# Altium schematic sheet Main.SchDoc
size 508 x 299 mm; SheetNumber: 1; SheetTotal: 2
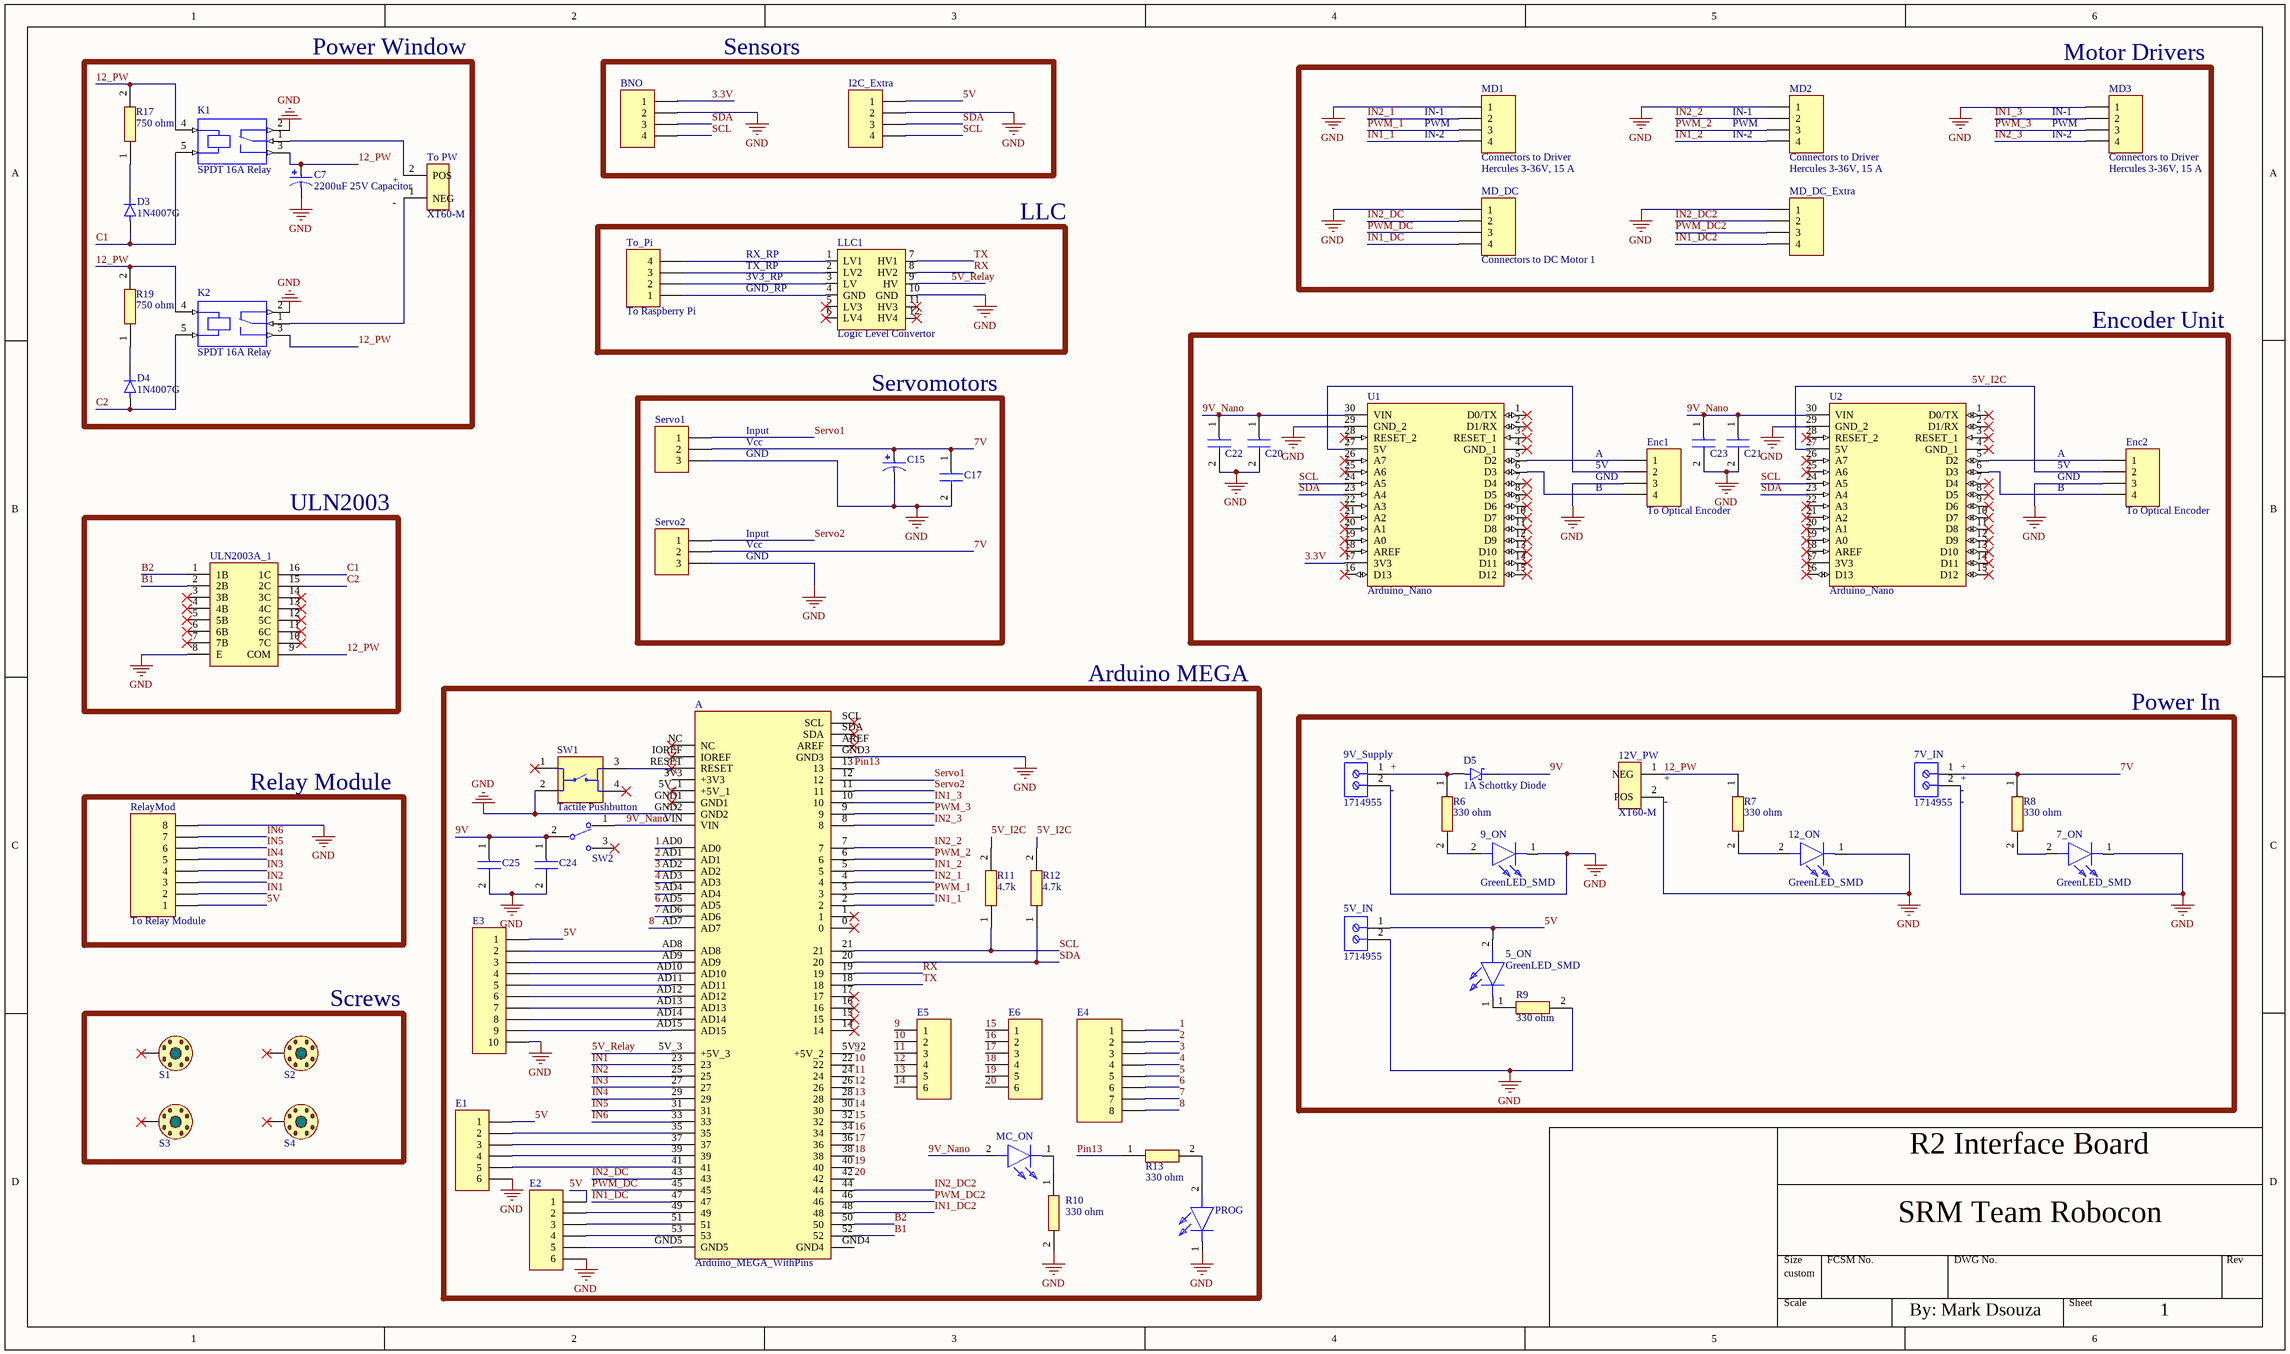
[diagram p0: Main.SchDoc]

## Parts
5_ON  GreenLED_SMD  [3mm LED]
5V_IN  1714955  [6.35mm 2 Way Screw Terminal]
7_ON  GreenLED_SMD  [3mm LED]
7V_IN  1714955  [6.35mm 2 Way Screw Terminal]
9_ON  GreenLED_SMD  [3mm LED]
9V_Supply  1714955  [6.35mm 2 Way Screw Terminal]
12_ON  GreenLED_SMD  [3mm LED]
12V_PW  XT60-M  [AMASS_XT60-M]
A  Arduino_MEGA_WithPins  [ARDUINO_MEGA_WithPins]
BNO  BNO  [Header JST 1X04]  (value not drawn)
C7  2200uF 25V Capacitor  [2200uF 25V Capacitor_FINAL]
C15  2200uF 25V Capacitor  [2200uF 25V Capacitor_FINAL]  (value not drawn)
C17  0.01uF Capacitor  [CAPC3216X170N]  (value not drawn)
C20  0.01uF Capacitor  [CAPC3216X170N]  (value not drawn)
C21  0.01uF Capacitor  [CAPC3216X170N]  (value not drawn)
C22  10 uF Capacitor  [CAPC3216X170N]  (value not drawn)
C23  10uF Capacitor  [CAPC3216X170N]  (value not drawn)
C24  0.01uF Capacitor  [CAPC3216X170N]  (value not drawn)
C25  10 uF Capacitor  [CAPC3216X170N]  (value not drawn)
D3  1N4007G  [1n4007]
D4  1N4007G  [1n4007]
D5  1A Schottky Diode  [1A Schottky Diode]
E1  Header 6  [My_1X06]  (value not drawn)
E2  Header 6  [My_1X06]  (value not drawn)
E3  Header 10  [MY_MA10-1]  (value not drawn)
E4  Header 8  [MY_1X08]  (value not drawn)
E5  Header 6  [My_1X06]  (value not drawn)
E6  Header 6  [My_1X06]  (value not drawn)
Enc1  To Optical Encoder  [Header JST 1X04]
Enc2  To Optical Encoder  [Header JST 1X04]
I2C_Extra  Header 4  [Header JST 1X04]  (value not drawn)
K1  SPDT 16A Relay  [relay JQX-15F(T90)]
K2  SPDT 16A Relay  [relay JQX-15F(T90)]
LLC1  Logic Level Convertor  [LLC]
MC_ON  GreenLED_SMD  [3mm LED]  (value not drawn)
MD1  Connectors to Driver  [Header JST 1X04]
MD2  Connectors to Driver  [Header JST 1X04]
MD3  Connectors to Driver  [Header JST 1X04]
MD_DC  Connectors to DC Motor 1  [Header JST 1X04]
MD_DC_Extra  Connectors to DC Motor 2  [Header JST 1X04]  (value not drawn)
PROG  GreenLED_SMD  [3mm LED]  (value not drawn)
R6  330 ohm  [RESC3116X65N]
R7  330 ohm  [RESC3116X65N]
R8  330 ohm  [RESC3116X65N]
R9  330 ohm  [RESC3116X65N]
R10  330 ohm  [RESC3116X65N]
R11  4.7k  [RESC3116X65N]
R12  4.7k  [RESC3116X65N]
R13  330 ohm  [RESC3116X65N]
R17  750 ohm  [RESC3116X65N]
R19  750 ohm  [RESC3116X65N]
RelayMod  To Relay Module  [Header JST 1X08]
S1  Screw  [SCREW-2MM]  (value not drawn)  (net tie, no BOM)
S2  Screw  [SCREW-2MM]  (value not drawn)  (net tie, no BOM)
S3  Screw  [SCREW-2MM]  (value not drawn)  (net tie, no BOM)
S4  Screw  [SCREW-2MM]  (value not drawn)  (net tie, no BOM)
Servo1  Header 3  [Header JST 1X03]  (value not drawn)
Servo2  Header 3  [Header JST 1X03]  (value not drawn)
SW1  Tactile Pushbutton  [Tactile Pushbutton]
SW2  1825115-1  [SPDT Slider Switch]  (value not drawn)
To_Pi  To Raspberry Pi  [Header JST 1X04]
To_PW  XT60-M  [AMASS_XT60-M]
U1  Arduino_Nano  [Arduino_Nano]
U2  Arduino_Nano  [Arduino_Nano]
ULN2003A_1  ULN2003AN  [ULN2003AN]  (value not drawn)

## Blocks framed on the sheet
Power Window: C7 D3 D4 K1 K2 R17 R19 To_PW
Sensors: BNO I2C_Extra
Motor Drivers: MD1-MD3 MD_DC MD_DC_Extra
LLC: LLC1 To_Pi
Encoder Unit: C20-C23 Enc1 Enc2 U1 U2
Servomotors: C15 C17 Servo1 Servo2
ULN2003: ULN2003A_1
Arduino MEGA: A C24 C25 E1-E6 MC_ON PROG R10-R13 SW1 SW2
Power In: 5_ON 5V_IN 7_ON 7V_IN 9_ON 9V_Supply 12_ON 12V_PW D5 R6-R9
Relay Module: RelayMod
Screws: S1-S4

## Nets
GND: 5V_IN.2 7_ON.1(K) 7V_IN.2 9_ON.1(K) 9V_Supply.2 12_ON.1(K) 12V_PW.2(POS) A.GND2 A.GND3 BNO.2 C7.N C15.N C17.2 C20.2 C21.2 C22.2 C23.2 C24.2 C25.2 E1.6 E2.6 E3.10 Enc1.3 Enc2.3 I2C_Extra.2 K1.2 K2.2 LLC1.10(GND) MD1.1 MD2.1 MD3.1 MD_DC.1 MD_DC_Extra.1 PROG.1(K) R9.2 R10.2 RelayMod.8 Servo1.3 Servo2.3 SW1.2 U1.29(GND_2) U2.29(GND_2) ULN2003A_1.8(E)
1: A.AD0 E4.1
2: A.AD1 E4.2
3: A.AD2 E4.3
3.3V: BNO.1 U1.17(3V3)
4: A.AD3 E4.4
5: A.AD4 E4.5
5V: 5_ON.2(A) 5V_IN.1 E1.1 E2.1 E3.1 I2C_Extra.1 RelayMod.1
5V_I2C: Enc2.2 R11.2 R12.2 U2.27(5V)
5V_Relay: A.5V_3(+5V_3) LLC1.9(HV)
6: A.AD5 E4.6
7: A.AD6 E4.7
7V: 7V_IN.1 C15.P C17.1 R8.1 Servo1.2 Servo2.2
8: A.AD7 E4.8
9: A.5V_2(+5V_2) E5.1
9V: C24.1 C25.1 D5.C(K) SW2.2
9V_Nano: A.VIN C20.1 C21.1 C22.1 C23.1 MC_ON.2(A) SW2.1 U1.30(VIN) U2.30(VIN)
10: A.22 E5.2
11: A.24 E5.3
12: A.26 E5.4
12_PW: 12V_PW.1(NEG) C7.P K1.3 K1.4(A1) K2.3 K2.4(A1) R7.1 R17.2 R19.2 ULN2003A_1.9(COM)
13: A.28 E5.5
14: A.30 E5.6
15: A.32 E6.1
16: A.34 E6.2
17: A.36 E6.3
18: A.38 E6.4
19: A.40 E6.5
20: A.42 E6.6
B1: A.52 ULN2003A_1.2(2B)
B2: A.50 ULN2003A_1.1(1B)
C1: D3.A K1.5(A2) ULN2003A_1.16(1C)
C2: D4.A K2.5(A2) ULN2003A_1.15(2C)
IN1: A.23 RelayMod.2
IN1_1: A.2 MD1.4
IN1_2: A.5 MD2.4
IN1_3: A.10 MD3.2
IN1_DC: A.47 MD_DC.4
IN1_DC2: A.48 MD_DC_Extra.4
IN2: A.25 RelayMod.3
IN2_1: A.4 MD1.2
IN2_2: A.7 MD2.2
IN2_3: A.8 MD3.4
IN2_DC: A.43 MD_DC.2
IN2_DC2: A.44 MD_DC_Extra.2
IN3: A.27 RelayMod.4
IN4: A.29 RelayMod.5
IN5: A.31 RelayMod.6
IN6: A.33 RelayMod.7
Pin13: A.13 R13.1
PWM_1: A.3 MD1.3
PWM_2: A.6 MD2.3
PWM_3: A.9 MD3.3
PWM_DC: A.45 MD_DC.3
PWM_DC2: A.46 MD_DC_Extra.3
RX: A.19 LLC1.8(HV2)
SCL: A.21 BNO.4 I2C_Extra.4 R11.1 U1.24(A5) U2.24(A5)
SDA: A.20 BNO.3 I2C_Extra.3 R12.1 U1.23(A4) U2.23(A4)
Servo1: A.12 Servo1.1
Servo2: A.11 Servo2.1
TX: A.18 LLC1.7(HV1)
Net5_ON_1: 5_ON.1(K) R9.1
Net7_ON_2: 7_ON.2(A) R8.2
Net9_ON_2: 9_ON.2(A) R6.2
Net9V_Supply_1: 9V_Supply.1 D5.A R6.1
Net12_ON_2: 12_ON.2(A) R7.2
NetA_35: A.35 E1.2
NetA_37: A.37 E1.3
NetA_39: A.39 E1.4
NetA_41: A.41 E1.5
NetA_49: A.49 E2.2
NetA_51: A.51 E2.3
NetA_53: A.53 E2.4
NetA_AD8: A.AD8 E3.2
NetA_AD9: A.AD9 E3.3
NetA_AD10: A.AD10 E3.4
NetA_AD11: A.AD11 E3.5
NetA_AD12: A.AD12 E3.6
NetA_AD13: A.AD13 E3.7
NetA_AD14: A.AD14 E3.8
NetA_AD15: A.AD15 E3.9
NetA_GND5: A.GND5 E2.5
NetA_RESET: A.RESET SW1.3
NetD3_C: D3.C(K) R17.1
NetD4_C: D4.C(K) R19.1
NetEnc1_1: Enc1.1 U1.5(D2)
NetEnc1_2: Enc1.2 U1.27(5V)
NetEnc1_4: Enc1.4 U1.6(D3)
NetEnc2_1: Enc2.1 U2.5(D2)
NetEnc2_4: Enc2.4 U2.6(D3)
NetK1_1: K1.1 To_PW.2(POS)
NetK2_1: K2.1 To_PW.1(NEG)
NetLLC1_1: LLC1.1(LV1) To_Pi.4
NetLLC1_2: LLC1.2(LV2) To_Pi.3
NetLLC1_3: LLC1.3(LV) To_Pi.2
NetLLC1_4: LLC1.4(GND) To_Pi.1
NetMC_ON_1: MC_ON.1(K) R10.1
NetPROG_2: PROG.2(A) R13.2

Not connected (* = marked no-connect by the designer): A 0* 1* 3V3(+3V3) 5V_1(+5V_1)* 14* 15* 16* 17* AREF* GND1* GND4 IOREF* NC* SCL* SDA*; LLC1 5(LV3)* 6(LV4)* 11(HV3)* 12(HV4)*; S1 0*; S2 0*; S3 0*; S4 0*; SW1 1* 4*; SW2 3*; U1 1(D0/TX)* 2(D1/RX)* 3(RESET_1)* 4(GND_1)* 7(D4)* 8(D5)* 9(D6)* 10(D7)* 11(D8)* 12(D9)* 13(D10)* 14(D11)* 15(D12)* 16(D13)* 18(AREF)* 19(A0)* 20(A1)* 21(A2)* 22(A3)* 25(A6)* 26(A7)* 28(RESET_2)*; U2 1(D0/TX)* 2(D1/RX)* 3(RESET_1)* 4(GND_1)* 7(D4)* 8(D5)* 9(D6)* 10(D7)* 11(D8)* 12(D9)* 13(D10)* 14(D11)* 15(D12)* 16(D13)* 17(3V3)* 18(AREF)* 19(A0)* 20(A1)* 21(A2)* 22(A3)* 25(A6)* 26(A7)* 28(RESET_2)*; ULN2003A_1 3(3B)* 4(4B)* 5(5B)* 6(6B)* 7(7B)* 10(7C)* 11(6C)* 12(5C)* 13(4C)* 14(3C)*

## Notes on the sheet
- (near MD1) IN-1
- (near MD2) IN-1
- (near MD3) IN-1
- (near MD1) PWM
- (near MD1) IN-2
- Hercules 3-36V, 15 A
- (near MD2) PWM
- (near MD2) IN-2
- (near MD3) PWM
- (near MD3) IN-2
- (near MD3) Hercules 3-36V, 15 A
- (near To_PW) +
- (near To_PW) -
- TX_RP
- RX_RP
- 3V3_RP
- GND_RP
- Vcc
- GND
- Input
- A
- (near Enc1) 5V
- (near Enc1) GND
- B
- 5V
- (near 9V_Supply) +
- (near 9V_Supply) -
- (near 12V_PW) +
- (near 12V_PW) -
- (near 7V_IN) +
- (near 7V_IN) -
- R2 Interface Board
- SRM Team Robocon
- By: Mark Dsouza
- 1

## Library data of the parts
5_ON 7_ON 9_ON 12_ON MC_ON PROG = GreenLED_SMD: LED; Manufacturer_Name: Wurth Elektronik; Manufacturer_Part_Number: 156120GS82500; Datasheet Link: https://componentsearchengine.com/Datasheets/2/156120GS82500.pdf; Height: 1.95mm; Mouser Part Number: 710-156120GS82500; Mouser Price/Stock: https://www.mouser.co.uk/ProductDetail/Wurth-Elektronik/156120GS82500?qs=5aG0NVq1C4ybFc4mIXNVFw%3D%3D
5V_IN 7V_IN 9V_Supply = 6.35mm 2 Way Screw Terminal: PC Terminal Block, Pitch 6.35 mm, 1 x 2 Position, Height 21.5 mm, Tail Lenght 5.1 mm, RoHS, Bulk; Manufacturer: Phoenix Contact; Package Description: PC Terminal Block, Pitch 6.35 mm, 1 x 2 Position, Height 21.5 mm, Tail Lenght 5.1 mm; Datasheet URL: http://media.digikey.com/pdf/Data%20Sheets/Phoenix%20Contact%20PDFs/1714955.pdf; Package Reference: 1714955; Manufacturer URL: http://www.phoenixcontact.com/; Datasheet Version: 02/2010; Mounting Technology: ThroughHole
12V_PW To_PW = XT60-M: Plug; DC supply; XT60; male; PIN: 2; for cable; soldered; 30A; 500V; MF: AMASS; MP: XT60-M; Price: None; Package: Package Analog Devices; Value: *; Availability: Unavailable; SnapEDA_Link: https://www.snapeda.com/parts/XT60-M/AMASS/view-part/2883912/?ref=snap
A = Arduino_MEGA_WithPins: ATmega2560 Arduino Mega2560 AVRÂ® ATmega AVR MCU 8-Bit Embedded Evaluation Board; MP: A000067; Availability: Unavailable; Package: None; SnapEDA_Link: https://www.snapeda.com/parts/A000067/Arduino/view-part/557398/?ref=snap; Price: None; Value: *; MF: Arduino
BNO Enc1 Enc2 I2C_Extra MD1-MD3 MD_DC MD_DC_Extra To_Pi = Header 4: Header, 4-Pin; ASiD Part Number: Header 4-AS
C7 C15 = 2200uF 25V Capacitor: Aluminum Electrolytic Capacitors, TA-A Series, 2200uF +/- 20%, 25V, Radial lead type(16x31.5mm); MF: Panasonic; MP: EEUTA1E222; Package: RADIAL-2 Panasonic; Purchase-URL: https://pricing.snapeda.com/search/part/EEUTA1E222/?ref=eda; Value: *; Availability: In Stock; SnapEDA_Link: https://www.snapeda.com/parts/EEUTA1E222/Panasonic/view-part/5784153/?ref=snap; Price: None; Check_prices: https://www.snapeda.com/parts/EEUTA1E222/Panasonic/view-part/5784153/?ref=eda
C17 C20-C25 = SMD Capacitor Package 1206: Capacitor; Manufacturer_Name: Vishay; Manufacturer_Part_Number: VJ1206Y103JXXPW1BC; Datasheet Link: http://www.vishay.com/docs/45200/vjhirelseries.pdf; Height: 1.7mm; Mouser Part Number: 77-VJ1206Y103JXXPBC; Mouser Price/Stock: https://www.mouser.com/Search/Refine.aspx?Keyword=77-VJ1206Y103JXXPBC
D3 D4 = 1N4007G: 1A, 1000V, Standard Recovery Rectifier; MF: Taiwan Semiconductor; Value: *; MP: 1N4007G; Purchase-URL: https://pricing.snapeda.com/search/part/1N4007G/?ref=eda; Check_prices: https://www.snapeda.com/parts/1N4007G/Taiwan+Semiconductor/view-part/?ref=eda; Price: None; Availability: In Stock; Package: DO-41 Taiwan Semiconductor; SnapEDA_Link: https://www.snapeda.com/parts/1N4007G/Taiwan+Semiconductor/view-part/?ref=snap
D5 = 1A Schottky Diode: 1A, 20V, Schottky Rectifier; MF: Taiwan Semiconductor; MP: SR102; Package: DO-41 Taiwan Semiconductor; Value: *; Purchase-URL: https://pricing.snapeda.com/search/part/SR102/?ref=eda; Availability: In Stock; Check_prices: https://www.snapeda.com/parts/SR102/Taiwan+Semiconductor/view-part/?ref=eda; SnapEDA_Link: https://www.snapeda.com/parts/SR102/Taiwan+Semiconductor/view-part/?ref=snap; Price: None
E1 E2 E5 E6 = Header 6: Header, 6-Pin; ASiD Part Number: Header 6-AS
E3 = Header 10: Header, 10-Pin; ASiD Part Number: Header 10-AS
E4 RelayMod = Header 8: Header, 8-Pin, Dual row; ASiD Part Number: Header 8-AS
K1 K2 = SPDT 16A Relay: Electromechanical Relay 12VDC 360Ohm 16A SPDT _29x12.7x15.7_mm THT Power Relay; MP: 6-1393238-2; MF: TE Connectivity; Availability: Unavailable; SnapEDA_Link: https://www.snapeda.com/parts/6-1393238-2/TE%20Connectivity%20Potter%20%26%20Brumfield%20Relays/view-part/265558/?ref=snap; Price: None; Package: None; TE_purchase_URL: https://www.te.com/usa-en/product-6-1393238-2.html?te_bu=Cor&te_type=disp&te_campaign=seda_glo_cor-seda-global-disp-prtnr-fy19-seda-model-bom-cta_sma-317_1&elqCampaignId=32493; Value: *
R6-R13 R17 R19 = SMD Resistor Package 1206: Resistor; Manufacturer_Name: KEMET; Manufacturer_Part_Number: RC1206JR-07750RL; Datasheet Link: https://datasheet.datasheetarchive.com/originals/distributors/Datasheets_SAMA/902f9e387b938f871d31120f5fc1d65e.pdf; Height: 0.65mm; Mouser Part Number: 603-RC1206JR-07750RL; Mouser Price/Stock: https://www.mouser.co.uk/ProductDetail/YAGEO/RC1206JR-07750RL?qs=CQ%2FIPMfstfiOJ3cqxJTt3Q%3D%3D
S1-S4 = Screw: 3mm Screw; ASiD Part Number: Screw-AS
Servo1 Servo2 = Header 3: Header, 3-Pin; ASiD Part Number: Header 3-AS
SW1 = Tactile Pushbutton: SWITCH TACTILE SPST-NO 0.05A 24V; MP: 1825910-2; Package: None; Value: *; Price: None; Availability: Unavailable
SW2 = ec4e4964ed0d2d669af15d5af94fda9: SWITCH SLIDE SPDT 250MA 125V; Manufacturer: TE Connectivity; Operating Force: 250gf; Electromechanical Life: 6000Cycles; Contact Resistance: 30mΩ; Voltage Rating Dc: 12V; Temperature Range High: +85°C; Manufacturer Part Number: 1825115-1; Temperature: -10°C to +85°C; Package: 1825115-1; Voltage Rating Ac: 125V; Category: Switch; Digikey Description: SWITCH SLIDE SPDT 250MA 125V; Throw Configuration: SPDT; RoHS: TRUE; Mount: Through Hole; Device Class L2: Switches; ComponentLink2Description: Datasheet; Automotive: No; ComponentLink2URL: https://www.te.com/usa-en/product-1825115-1.html?te_bu=Cor&te_type=other&te_campaign=oct_glo_cor-oct-global-oth-prtnr-fy19-oct-octo-buy-bom_sma-298_2&elqCampaignId=35216; Contact Current Rating: 250mA; Temperature Range Low: -10°C; Device Class L3: Slide Switches; Device Class L1: Electromechanical; Octopart: https://octopart.com/sls121pc04-te+connectivity-39426454; Lead Free: Yes
U1 U2 = Arduino_Nano: CLOCK SAW OSCILLATOR SEAM7050 T&; MP: A000005; Value: *; Digi-Key_Purchase_URL: https://www.digikey.com/product-detail/en/diodes-incorporated/SPA000005J/SPA000005J-ND/9769570?utm_source=snapeda&utm_medium=aggregator&utm_campaign=symbol; SnapEDA_Link: https://www.snapeda.com/parts/A000005/Arduino/view-part/51027/?ref=snap; Digi-Key_Part_Number: SPA000005J-ND; MF: Arduino; Package: None
ULN2003A_1 = ULN2003AN: Transistor; Manufacturer_Name: Texas Instruments; Datasheet Link: http://www.ti.com/lit/gpn/uln2003a; Height: 5.08mm; Manufacturer_Part_Number: ULN2003AN; Mouser Part Number: 595-ULN2003AN; Mouser Price/Stock: https://www.mouser.co.uk/ProductDetail/Texas-Instruments/ULN2003AN?qs=FOlmdCx%252BAA1wYQ1G8c8hpQ%3D%3D; Arrow Part Number: ULN2003AN; Arrow Price/Stock: https://www.arrow.com/en/products/uln2003an/texas-instruments?region=nac